# EAGLE schematic PT08ttl (EAGLE 6.6.0)

## Sheet 1 of 2
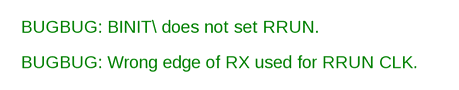
[diagram p0: schematic, sheet 1, part 1 of 2]
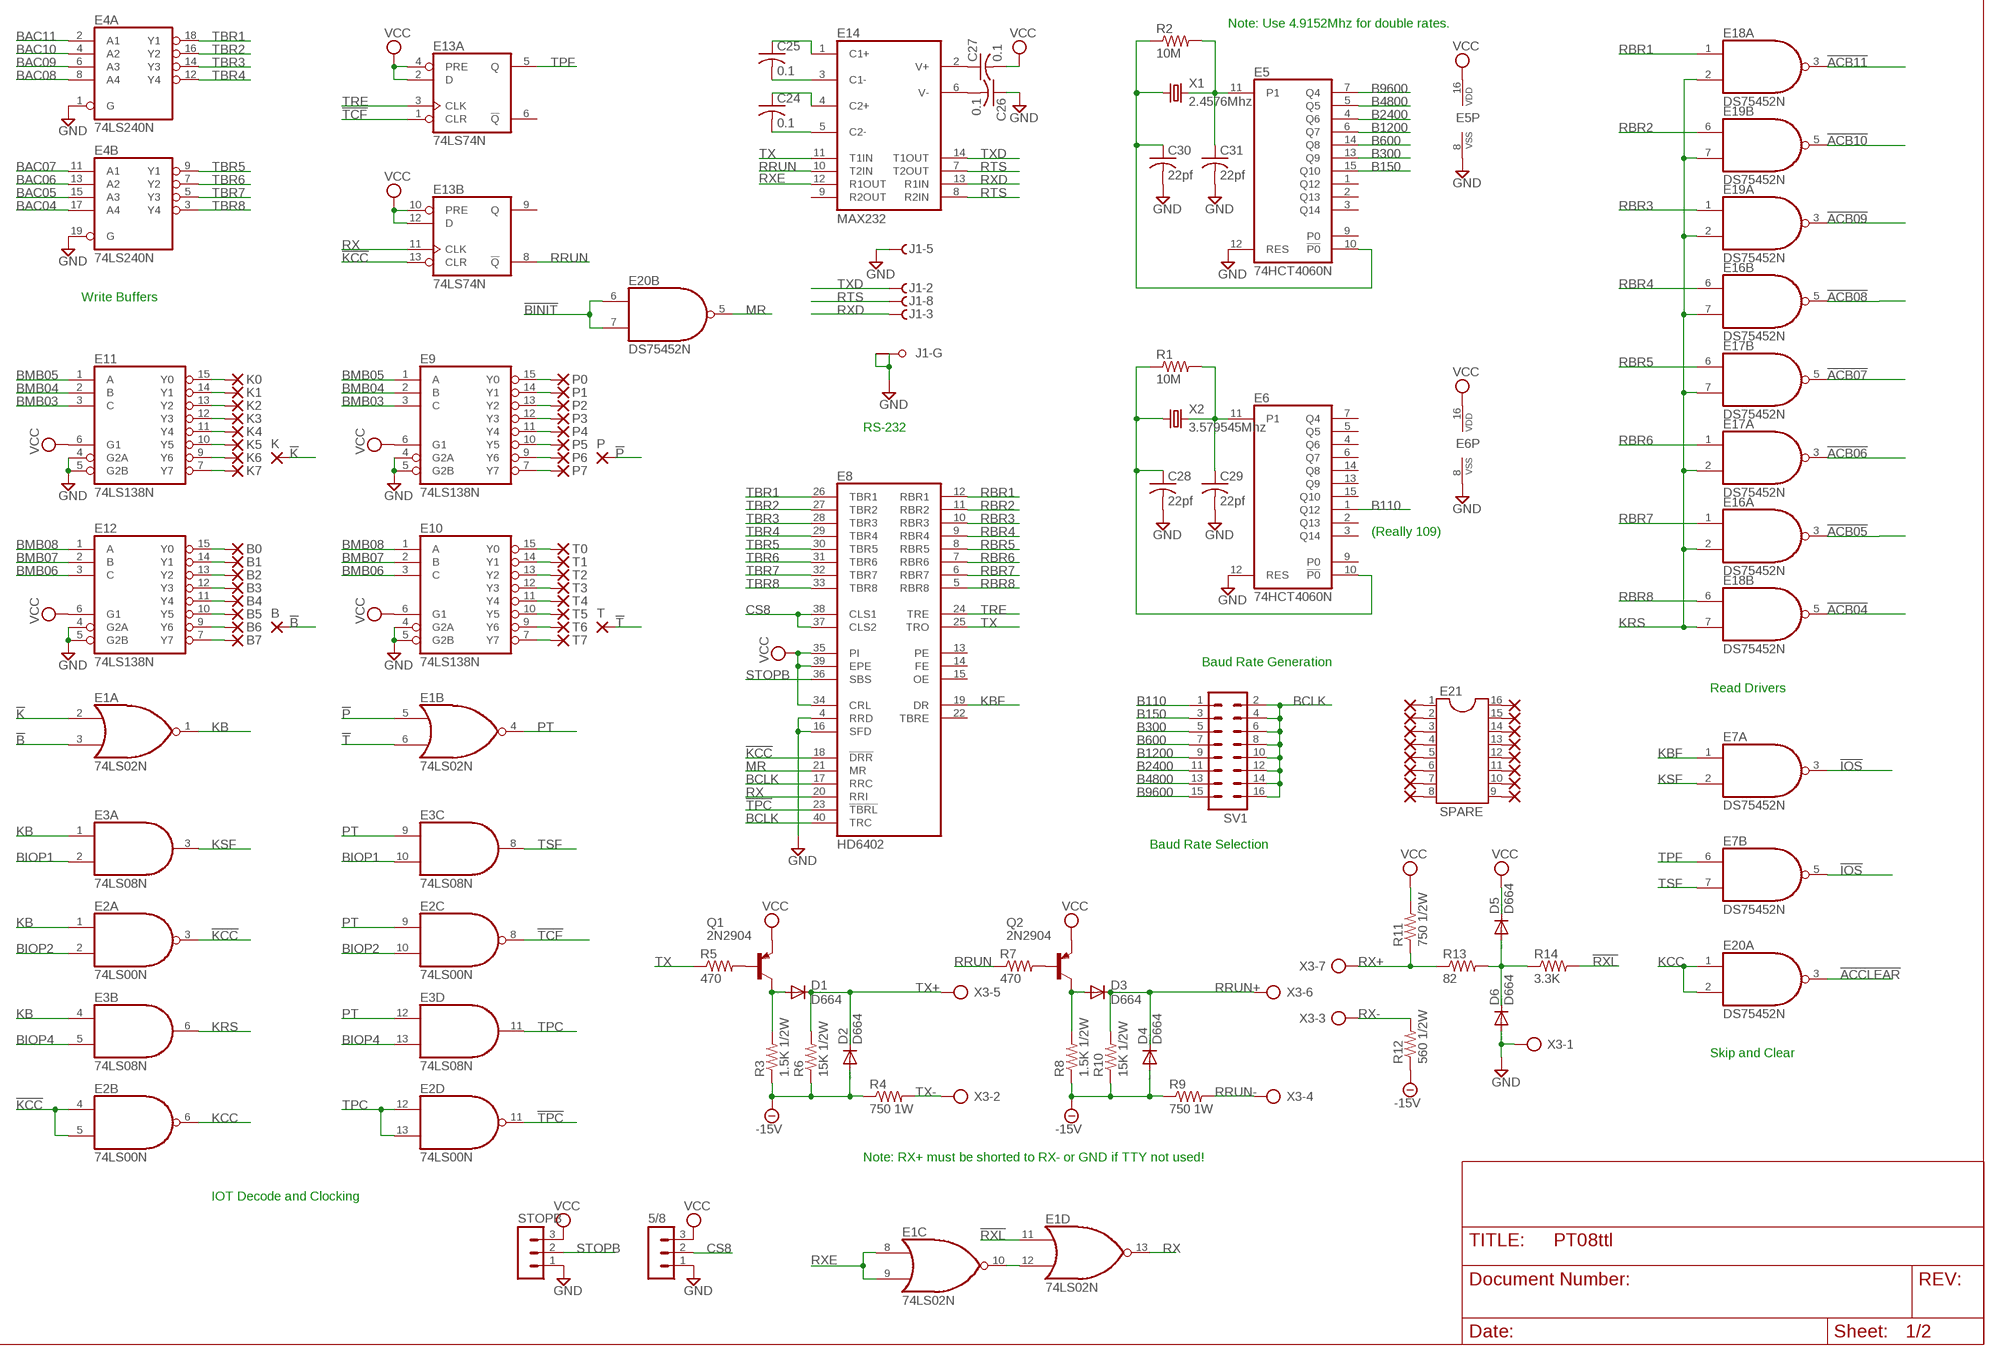
[diagram p1: schematic, sheet 1, part 2 of 2]

### Parts
5/8  MA03-1  [MA03-1]
B  1,6/0,8  [1,6/0,8]
B0  1,6/0,8  [1,6/0,8]
B1  1,6/0,8  [1,6/0,8]
B2  1,6/0,8  [1,6/0,8]
B3  1,6/0,8  [1,6/0,8]
B4  1,6/0,8  [1,6/0,8]
B5  1,6/0,8  [1,6/0,8]
B6  1,6/0,8  [1,6/0,8]
B7  1,6/0,8  [1,6/0,8]
C24  0.1  C-US050-025X075  [C050-025X075]
C25  0.1  C-US050-025X075  [C050-025X075]
C26  0.1  C-US050-025X075  [C050-025X075]
C27  0.1  C-US050-025X075  [C050-025X075]
C28  22pf  C-US050-025X075  [C050-025X075]
C29  22pf  C-US050-025X075  [C050-025X075]
C30  22pf  C-US050-025X075  [C050-025X075]
C31  22pf  C-US050-025X075  [C050-025X075]
D1  D664  1N4148DO35-10  [DO35-10]
D2  D664  1N4148DO35-10  [DO35-10]
D3  D664  1N4148DO35-10  [DO35-10]
D4  D664  1N4148DO35-10  [DO35-10]
D5  D664  1N4148DO35-10  [DO35-10]
D6  D664  1N4148DO35-10  [DO35-10]
E1  74LS02N  [DIL14]
E2  74LS00N  [DIL14]
E3  74LS08N  [DIL14]
E4  74LS240N  [DIL20]
E5  74HCT4060N  4060N  [DIL16]
E6  74HCT4060N  4060N  [DIL16]
E7  DS75452N  [DIL08]
E8  HD6402  [DIL40]
E9  74LS138N  [DIL16]
E10  74LS138N  [DIL16]
E11  74LS138N  [DIL16]
E12  74LS138N  [DIL16]
E13  74LS74N  [DIL14]
E14  MAX232  [DIL16]
E16  DS75452N  [DIL08]
E17  DS75452N  [DIL08]
E18  DS75452N  [DIL08]
E19  DS75452N  [DIL08]
E20  DS75452N  [DIL08]
E21  SPARE  DIL16  [DIL16]
J1  F09HPS  [F09HP]
K  1,6/0,8  [1,6/0,8]
K0  1,6/0,8  [1,6/0,8]
K1  1,6/0,8  [1,6/0,8]
K2  1,6/0,8  [1,6/0,8]
K3  1,6/0,8  [1,6/0,8]
K4  1,6/0,8  [1,6/0,8]
K5  1,6/0,8  [1,6/0,8]
K6  1,6/0,8  [1,6/0,8]
K7  1,6/0,8  [1,6/0,8]
P  1,6/0,8  [1,6/0,8]
P0  1,6/0,8  [1,6/0,8]
P1  1,6/0,8  [1,6/0,8]
P2  1,6/0,8  [1,6/0,8]
P3  1,6/0,8  [1,6/0,8]
P4  1,6/0,8  [1,6/0,8]
P5  1,6/0,8  [1,6/0,8]
P6  1,6/0,8  [1,6/0,8]
P7  1,6/0,8  [1,6/0,8]
PAD18  1,6/0,8  [1,6/0,8]
PAD19  1,6/0,8  [1,6/0,8]
PAD28  1,6/0,8  [1,6/0,8]
PAD29  1,6/0,8  [1,6/0,8]
PAD30  1,6/0,8  [1,6/0,8]
PAD31  1,6/0,8  [1,6/0,8]
PAD32  1,6/0,8  [1,6/0,8]
PAD33  1,6/0,8  [1,6/0,8]
PAD34  1,6/0,8  [1,6/0,8]
PAD35  1,6/0,8  [1,6/0,8]
PAD36  1,6/0,8  [1,6/0,8]
PAD37  1,6/0,8  [1,6/0,8]
PAD38  1,6/0,8  [1,6/0,8]
PAD39  1,6/0,8  [1,6/0,8]
PAD40  1,6/0,8  [1,6/0,8]
PAD41  1,6/0,8  [1,6/0,8]
Q1  2N2904  [TO39]
Q2  2N2904  [TO39]
R1  10M  R-US_0207/10  [0207/10]
R2  10M  R-US_0207/10  [0207/10]
R3  1.5K 1/2W  R-US_0207/10  [0207/10]
R4  750 1W  R-US_0207/10  [0207/10]
R5  470  R-US_0207/10  [0207/10]
R6  15K 1/2W  R-US_0207/10  [0207/10]
R7  470  R-US_0207/10  [0207/10]
R8  1.5K 1/2W  R-US_0207/10  [0207/10]
R9  750 1W  R-US_0207/10  [0207/10]
R10  15K 1/2W  R-US_0207/10  [0207/10]
R11  750 1/2W  R-US_0207/10  [0207/10]
R12  560 1/2W  R-US_0207/10  [0207/10]
R13  82  R-US_0207/10  [0207/10]
R14  3.3K  R-US_0207/10  [0207/10]
STOPB  MA03-1  [MA03-1]
SV1  MA08-2  [MA08-2]
T  1,6/0,8  [1,6/0,8]
T0  1,6/0,8  [1,6/0,8]
T1  1,6/0,8  [1,6/0,8]
T2  1,6/0,8  [1,6/0,8]
T3  1,6/0,8  [1,6/0,8]
T4  1,6/0,8  [1,6/0,8]
T5  1,6/0,8  [1,6/0,8]
T6  1,6/0,8  [1,6/0,8]
T7  1,6/0,8  [1,6/0,8]
X1  2.4576Mhz  CRYSTALHC49U-V  [HC49U-V]
X2  3.579545Mhz  CRYSTALHC49U-V  [HC49U-V]
X3  AK300/7  [AK300/7]

### Nets
!ACB04: E18.5(B:O) ; also sheet 2
!ACB05: E16.3(A:O) ; also sheet 2
!ACB06: E17.3(A:O) ; also sheet 2
!ACB07: E17.5(B:O) ; also sheet 2
!ACB08: E16.5(B:O) ; also sheet 2
!ACB09: E19.3(A:O) ; also sheet 2
!ACB10: E19.5(B:O) ; also sheet 2
!ACB11: E18.3(A:O) ; also sheet 2
!ACCLEAR: E20.3(A:O) ; also sheet 2
!B: B.1(P) E1.3(A:I1)
!BINIT: E20.6(B:I0) E20.7(B:I1) ; also sheet 2
!IOS: E7.3(A:O) E7.5(B:O) ; also sheet 2
!K: E1.2(A:I0) K.1(P)
!KCC: E2.3(A:O) E2.4(B:I0) E2.5(B:I1) E8.18(!DRR) E13.13(B:CLR)
!P: E1.5(B:I0) P.1(P)
!RXL: E1.11(D:I0) R14.2
!T: E1.6(B:I1) T.1(P)
!TCF: E2.8(C:O) E13.1(A:CLR)
!TPC: E2.11(D:O) E8.23(!TBRL)
-15V [supply]: D2.A D4.A R3.1 R4.1 R6.1 R8.1 R9.1 R10.1 R12.1 ; also sheet 2
B110: E6.1(Q12) SV1.1
B150: E5.15(Q10) SV1.3
B300: E5.13(Q9) SV1.5
B600: E5.14(Q8) SV1.7
B1200: E5.6(Q7) SV1.9
B2400: E5.4(Q6) SV1.11
B4800: E5.5(Q5) SV1.13
B9600: E5.7(Q4) SV1.15
BAC04: E4.17(B:A4) ; also sheet 2
BAC05: E4.15(B:A3) ; also sheet 2
BAC06: E4.13(B:A2) ; also sheet 2
BAC07: E4.11(B:A1) ; also sheet 2
BAC08: E4.8(A:A4) ; also sheet 2
BAC09: E4.6(A:A3) ; also sheet 2
BAC10: E4.4(A:A2) ; also sheet 2
BAC11: E4.2(A:A1) ; also sheet 2
BCLK: E8.17(RRC) E8.40(TRC) SV1.2 SV1.4 SV1.6 SV1.8 SV1.10 SV1.12 SV1.14 SV1.16
BIOP1: E3.2(A:I1) E3.10(C:I1) ; also sheet 2
BIOP2: E2.2(A:I1) E2.10(C:I1) ; also sheet 2
BIOP4: E3.5(B:I1) E3.13(D:I1) ; also sheet 2
BMB03: E9.3(C) E11.3(C) ; also sheet 2
BMB04: E9.2(B) E11.2(B) ; also sheet 2
BMB05: E9.1(A) E11.1(A) ; also sheet 2
BMB06: E10.3(C) E12.3(C) ; also sheet 2
BMB07: E10.2(B) E12.2(B) ; also sheet 2
BMB08: E10.1(A) E12.1(A) ; also sheet 2
CS8: 5/8.2 E8.37(CLS2) E8.38(CLS1)
GND [supply]: 5/8.1 C26.1 C28.2 C29.2 C30.2 C31.2 D6.A E4.1(A:G) E4.19(B:G) E5.8(VSS) E5.12(RES) E6.8(VSS) E6.12(RES) E8.4(RRD) E8.16(SFD) E9.4(G2A) E9.5(G2B) E10.4(G2A) E10.5(G2B) E11.4(G2A) E11.5(G2B) E12.4(G2A) E12.5(G2B) J1.5(-5:F) J1.G1(-G:G1) J1.G2(-G:G2) STOPB.1 X3.1 ; also sheet 2
KB: E1.1(A:O) E2.1(A:I0) E3.1(A:I0) E3.4(B:I0)
KBF: E7.1(A:I0) E8.19(DR)
KCC: E2.6(B:O) E20.1(A:I0) E20.2(A:I1)
KRS: E3.6(B:O) E16.2(A:I1) E16.7(B:I1) E17.2(A:I1) E17.7(B:I1) E18.2(A:I1) E18.7(B:I1) E19.2(A:I1) E19.7(B:I1)
KSF: E3.3(A:O) E7.2(A:I1)
MR: E8.21(MR) E20.5(B:O)
N$1: B6.1(P) E12.9(Y6)
N$5: B0.1(P) E12.15(Y0)
N$6: B1.1(P) E12.14(Y1)
N$7: B2.1(P) E12.13(Y2)
N$8: B3.1(P) E12.12(Y3)
N$9: B4.1(P) E12.11(Y4)
N$10: B5.1(P) E12.10(Y5)
N$11: B7.1(P) E12.7(Y7)
N$13: C29.1 E6.11(P1) R1.2 X2.2
N$14: C28.1 E6.10(!P0) R1.1 X2.1
N$15 [supply]: C26.2 E14.6(V-)
N$16 [supply]: C27.1 E14.2(V+)
N$17: Q1.2(B) R5.2
N$18: D1.A Q1.3(C) R3.2
N$19: Q2.2(B) R7.2
N$20: D3.A Q2.3(C) R8.2
N$22: C24.2 E14.5(C2-)
N$23: C30.1 E5.10(!P0) R2.1 X1.1
N$24: D5.A D6.C R13.2 R14.1
N$25: C31.1 E5.11(P1) R2.2 X1.2
N$27: E1.10(C:O) E1.12(D:I1)
N$32: C25.2 E14.3(C1-)
N$34: E21.1 PAD18.1(P)
N$41: E21.2 PAD19.1(P)
N$43: E21.3 PAD28.1(P)
N$44: C24.1 E14.4(C2+)
N$45: C25.1 E14.1(C1+)
N$49: E10.15(Y0) T0.1(P)
N$50: E21.4 PAD29.1(P)
N$51: E21.5 PAD30.1(P)
N$52: E21.6 PAD31.1(P)
N$53: E21.7 PAD32.1(P)
N$54: E21.8 PAD33.1(P)
N$55: E21.16 PAD34.1(P)
N$56: E21.15 PAD35.1(P)
N$57: E21.14 PAD36.1(P)
N$58: E21.13 PAD37.1(P)
N$59: E21.12 PAD38.1(P)
N$61: E21.11 PAD39.1(P)
N$68: E21.10 PAD40.1(P)
N$69: E21.9 PAD41.1(P)
N$90: E11.15(Y0) K0.1(P)
N$91: E11.14(Y1) K1.1(P)
N$97: E11.13(Y2) K2.1(P)
N$109: E11.12(Y3) K3.1(P)
N$112: E11.11(Y4) K4.1(P)
N$113: E11.10(Y5) K5.1(P)
N$114: E11.7(Y7) K7.1(P)
N$115: E11.9(Y6) K6.1(P)
N$116: E10.14(Y1) T1.1(P)
N$117: E10.13(Y2) T2.1(P)
N$118: E10.12(Y3) T3.1(P)
N$119: E10.11(Y4) T4.1(P)
N$120: E10.10(Y5) T5.1(P)
N$121: E10.7(Y7) T7.1(P)
N$122: E10.9(Y6) T6.1(P)
N$123: E9.15(Y0) P0.1(P)
N$124: E9.14(Y1) P1.1(P)
N$125: E9.13(Y2) P2.1(P)
N$126: E9.12(Y3) P3.1(P)
N$127: E9.11(Y4) P4.1(P)
N$128: E9.10(Y5) P5.1(P)
N$129: E9.7(Y7) P7.1(P)
N$130: E9.9(Y6) P6.1(P)
PT: E1.4(B:O) E2.9(C:I0) E3.9(C:I0) E3.12(D:I0)
RBR1: E8.12(RBR1) E18.1(A:I0)
RBR2: E8.11(RBR2) E19.6(B:I0)
RBR3: E8.10(RBR3) E19.1(A:I0)
RBR4: E8.9(RBR4) E16.6(B:I0)
RBR5: E8.8(RBR5) E17.6(B:I0)
RBR6: E8.7(RBR6) E17.1(A:I0)
RBR7: E8.6(RBR7) E16.1(A:I0)
RBR8: E8.5(RBR8) E18.6(B:I0)
RRUN: E13.8(B:!Q) E14.10(T2IN) R7.1
RRUN+: D3.C D4.C R10.2 X3.6
RRUN-: R9.2 X3.4
RTS: E14.7(T2OUT) E14.8(R2IN) J1.8(-8:F)
RX: E1.13(D:O) E8.20(RRI) E13.11(B:CLK)
RX+: R11.1 R13.1 X3.7
RX-: R12.2 X3.3
RXD: E14.13(R1IN) J1.3(-3:F)
RXE: E1.8(C:I0) E1.9(C:I1) E14.12(R1OUT)
STOPB: E8.36(SBS) STOPB.2
TBR1: E4.18(A:Y1) E8.26(TBR1)
TBR2: E4.16(A:Y2) E8.27(TBR2)
TBR3: E4.14(A:Y3) E8.28(TBR3)
TBR4: E4.12(A:Y4) E8.29(TBR4)
TBR5: E4.9(B:Y1) E8.30(TBR5)
TBR6: E4.7(B:Y2) E8.31(TBR6)
TBR7: E4.5(B:Y3) E8.32(TBR7)
TBR8: E4.3(B:Y4) E8.33(TBR8)
TPC: E2.12(D:I0) E2.13(D:I1) E3.11(D:O)
TPF: E7.6(B:I0) E13.5(A:Q)
TRE: E8.24(TRE) E13.3(A:CLK)
TSF: E3.8(C:O) E7.7(B:I1)
TX: E8.25(TRO) E14.11(T1IN) R5.1
TX+: D1.C D2.C R6.2 X3.5
TX-: R4.2 X3.2
TXD: E14.14(T1OUT) J1.2(-2:F)
VCC [supply]: 5/8.3 C27.2 D5.C E5.16(VDD) E6.16(VDD) E8.34(CRL) E8.35(PI) E8.39(EPE) E9.6(G1) E10.6(G1) E11.6(G1) E12.6(G1) E13.2(A:D) E13.4(A:PRE) E13.10(B:PRE) E13.12(B:D) Q1.1(E) Q2.1(E) R11.2 STOPB.3 ; also sheet 2
Unconnected: E5.1(Q12) E5.2(Q13) E5.3(Q14) E5.9(P0) E6.2(Q13) E6.3(Q14) E6.4(Q6) E6.5(Q5) E6.6(Q7) E6.7(Q4) E6.9(P0) E6.13(Q9) E6.14(Q8) E6.15(Q10) E8.13(PE) E8.14(FE) E8.15(OE) E8.22(TBRE) E13.6(A:!Q) E13.9(B:Q) E14.9(R2OUT) J1.1(-1:F) J1.4(-4:F) J1.6(-6:F) J1.7(-7:F) J1.9(-9:F)

### Notes on the sheet
- Note: Use 4.9152Mhz for double rates.
- BUGBUG: BINIT\\ does not set RRUN.
- BUGBUG: Wrong edge of RX used for RRUN CLK.
- Write Buffers
- RS-232
- (Really 109)
- Baud Rate Generation
- Read Drivers
- Baud Rate Selection
- Skip and Clear
- Note: RX+ must be shorted to RX- or GND if TTY not used!
- IOT Decode and Clocking

## Sheet 2 of 2
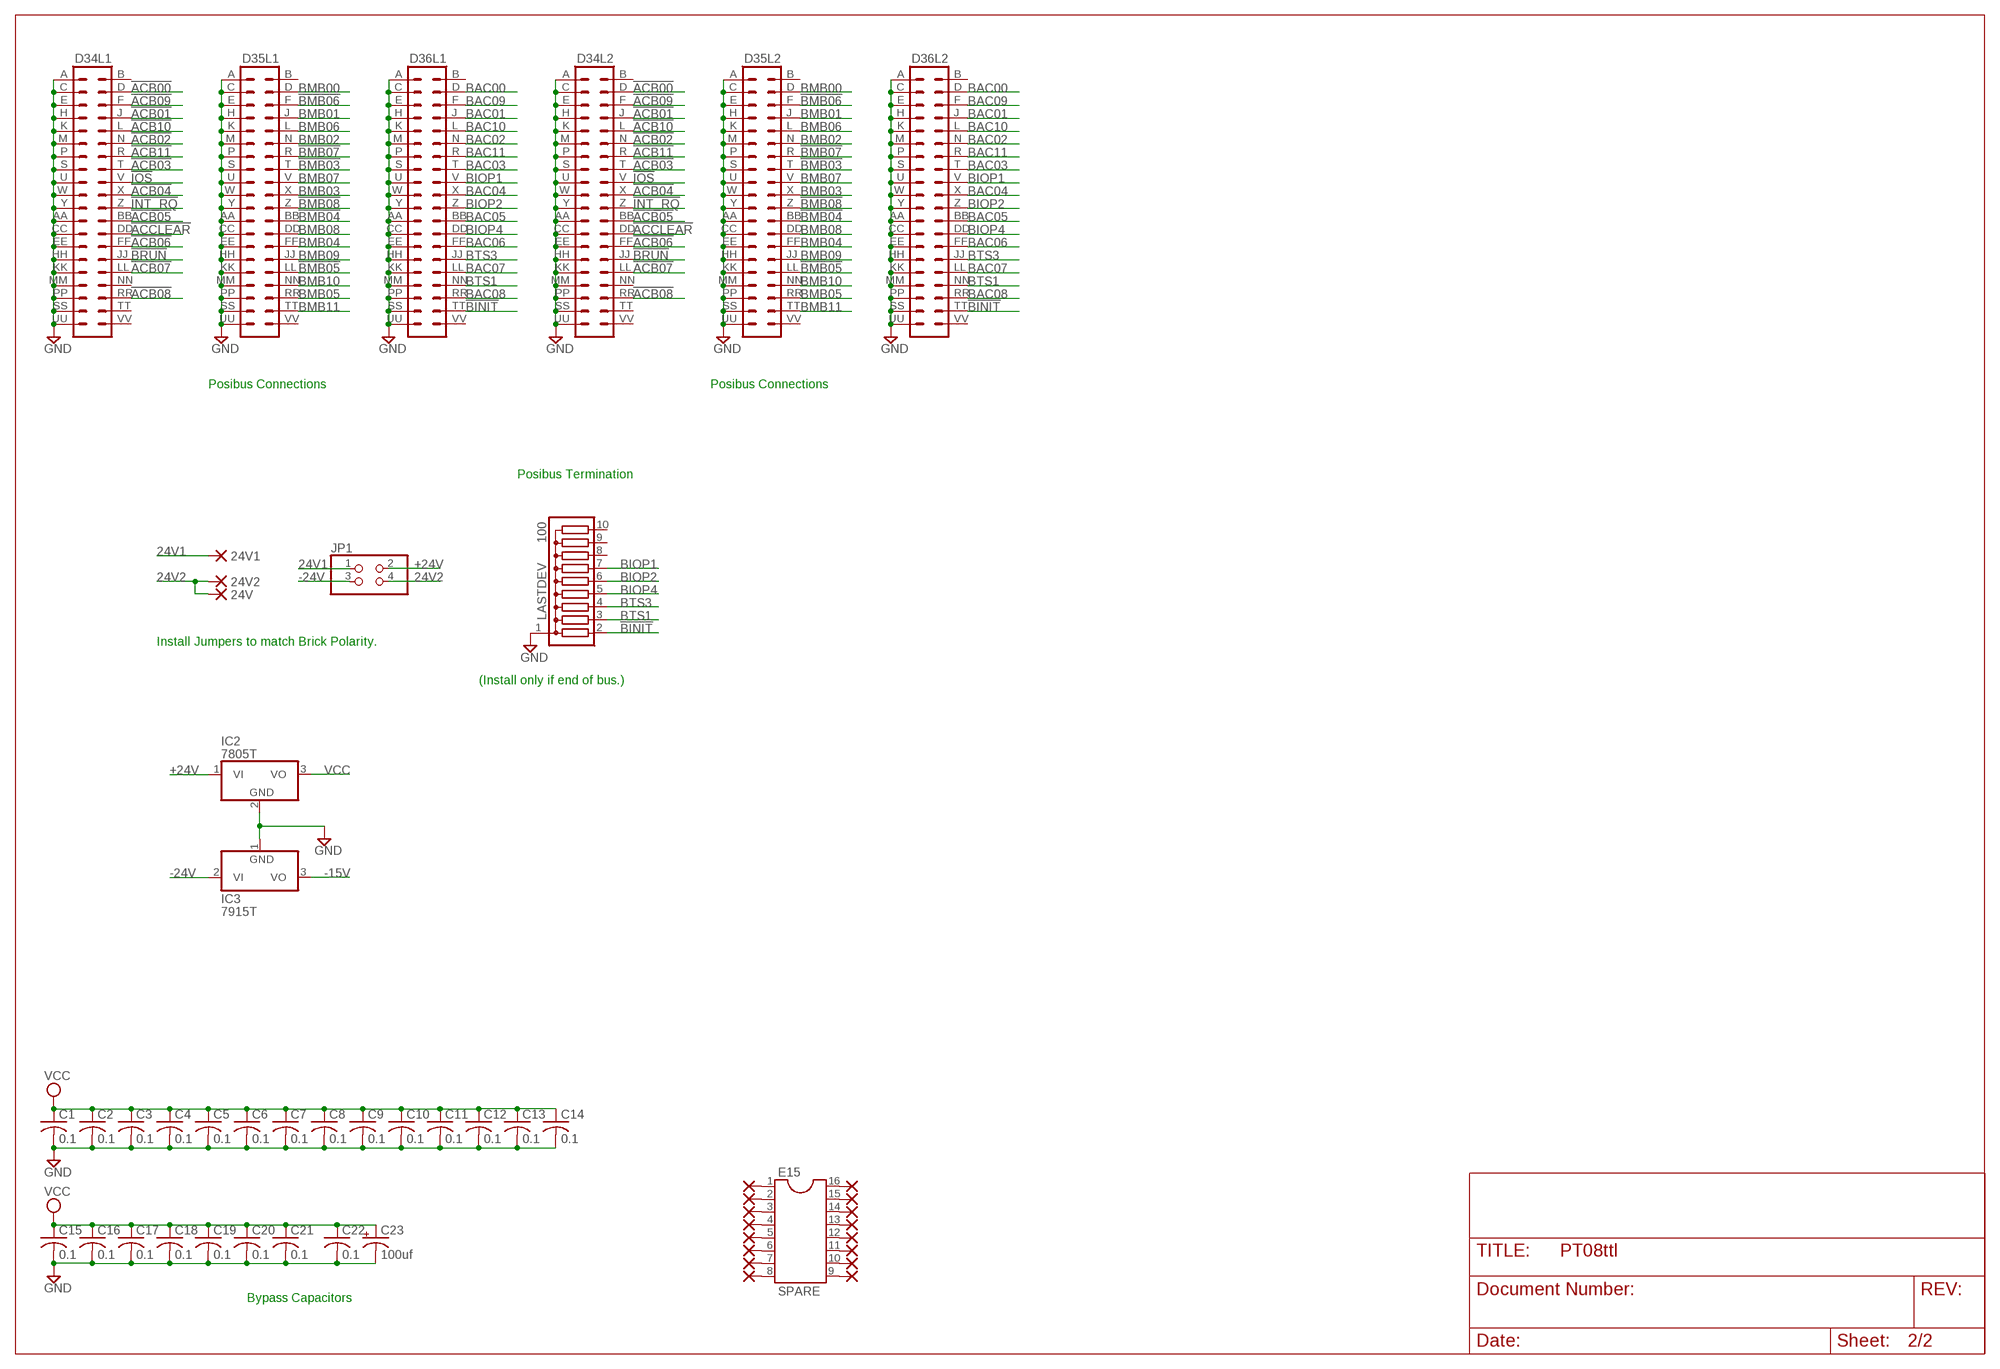
[diagram p2: schematic, sheet 2]

### Parts
24V  PAD-0820  [0820]
24V1  PAD-0820  [0820]
24V2  PAD-0820  [0820]
C1  0.1  C-US050-025X075  [C050-025X075]
C2  0.1  C-US050-025X075  [C050-025X075]
C3  0.1  C-US050-025X075  [C050-025X075]
C4  0.1  C-US050-025X075  [C050-025X075]
C5  0.1  C-US050-025X075  [C050-025X075]
C6  0.1  C-US050-025X075  [C050-025X075]
C7  0.1  C-US050-025X075  [C050-025X075]
C8  0.1  C-US050-025X075  [C050-025X075]
C9  0.1  C-US050-025X075  [C050-025X075]
C10  0.1  C-US050-025X075  [C050-025X075]
C11  0.1  C-US050-025X075  [C050-025X075]
C12  0.1  C-US050-025X075  [C050-025X075]
C13  0.1  C-US050-025X075  [C050-025X075]
C14  0.1  C-US050-025X075  [C050-025X075]
C15  0.1  C-US050-025X075  [C050-025X075]
C16  0.1  C-US050-025X075  [C050-025X075]
C17  0.1  C-US050-025X075  [C050-025X075]
C18  0.1  C-US050-025X075  [C050-025X075]
C19  0.1  C-US050-025X075  [C050-025X075]
C20  0.1  C-US050-025X075  [C050-025X075]
C21  0.1  C-US050-025X075  [C050-025X075]
C22  0.1  C-US050-025X075  [C050-025X075]
C23  100uf  CPOL-USE22-9AXIAL  [E22-9]
D34L1  DEC40PINV  [DEC40PINV]
D34L2  DEC40PINV  [DEC40PINV]
D35L1  DEC40PINV  [DEC40PINV]
D35L2  DEC40PINV  [DEC40PINV]
D36L1  DEC40PINV  [DEC40PINV]
D36L2  DEC40PINV  [DEC40PINV]
E15  SPARE  DIL16  [DIL16]
IC2  7805T  [TO220H]
IC3  7915T  [TO220H]
JP1  PINHD-2X2  [2X02]
LASTDEV  100  G09R  [SIL10]
PAD1  1,6/0,8  [1,6/0,8]
PAD2  1,6/0,8  [1,6/0,8]
PAD3  1,6/0,8  [1,6/0,8]
PAD4  1,6/0,8  [1,6/0,8]
PAD5  1,6/0,8  [1,6/0,8]
PAD6  1,6/0,8  [1,6/0,8]
PAD7  1,6/0,8  [1,6/0,8]
PAD8  1,6/0,8  [1,6/0,8]
PAD9  1,6/0,8  [1,6/0,8]
PAD42  1,6/0,8  [1,6/0,8]
PAD43  1,6/0,8  [1,6/0,8]
PAD44  1,6/0,8  [1,6/0,8]
PAD45  1,6/0,8  [1,6/0,8]
PAD46  1,6/0,8  [1,6/0,8]
PAD47  1,6/0,8  [1,6/0,8]
PAD48  1,6/0,8  [1,6/0,8]

### Nets
24V1 [supply]: 24V1.P$1(P) JP1.1
24V2 [supply]: 24V2.P$1(P) 24V.P$1(P) JP1.4
!ACB00: D34L1.D D34L2.D
!ACB01: D34L1.J D34L2.J
!ACB02: D34L1.N D34L2.N
!ACB03: D34L1.T D34L2.T
!ACB04: D34L1.X D34L2.X ; also sheet 1
!ACB05: D34L1.BB D34L2.BB ; also sheet 1
!ACB06: D34L1.FF D34L2.FF ; also sheet 1
!ACB07: D34L1.LL D34L2.LL ; also sheet 1
!ACB08: D34L1.RR D34L2.RR ; also sheet 1
!ACB09: D34L1.F D34L2.F ; also sheet 1
!ACB10: D34L1.L D34L2.L ; also sheet 1
!ACB11: D34L1.R D34L2.R ; also sheet 1
!ACCLEAR: D34L1.DD D34L2.DD ; also sheet 1
!BINIT: D36L1.TT D36L2.TT LASTDEV.2 ; also sheet 1
!BMB03: D35L1.T D35L2.T
!BMB04: D35L1.BB D35L2.BB
!BMB05: D35L1.LL D35L2.LL
!BMB06: D35L1.F D35L2.F
!BMB07: D35L1.R D35L2.R
!BMB08: D35L1.Z D35L2.Z
!BRUN: D34L1.JJ D34L2.JJ
!INT_RQ: D34L1.Z D34L2.Z
!IOS: D34L1.V D34L2.V ; also sheet 1
+24V [supply]: IC2.1(VI) JP1.2
-15V [supply]: IC3.3(VO) ; also sheet 1
-24V [supply]: IC3.2(VI) JP1.3
BAC00: D36L1.D D36L2.D
BAC01: D36L1.J D36L2.J
BAC02: D36L1.N D36L2.N
BAC03: D36L1.T D36L2.T
BAC04: D36L1.X D36L2.X ; also sheet 1
BAC05: D36L1.BB D36L2.BB ; also sheet 1
BAC06: D36L1.FF D36L2.FF ; also sheet 1
BAC07: D36L1.LL D36L2.LL ; also sheet 1
BAC08: D36L1.RR D36L2.RR ; also sheet 1
BAC09: D36L1.F D36L2.F ; also sheet 1
BAC10: D36L1.L D36L2.L ; also sheet 1
BAC11: D36L1.R D36L2.R ; also sheet 1
BIOP1: D36L1.V D36L2.V LASTDEV.7 ; also sheet 1
BIOP2: D36L1.Z D36L2.Z LASTDEV.6 ; also sheet 1
BIOP4: D36L1.DD D36L2.DD LASTDEV.5 ; also sheet 1
BMB00: D35L1.D D35L2.D
BMB01: D35L1.J D35L2.J
BMB02: D35L1.N D35L2.N
BMB03: D35L1.X D35L2.X ; also sheet 1
BMB04: D35L1.FF D35L2.FF ; also sheet 1
BMB05: D35L1.RR D35L2.RR ; also sheet 1
BMB06: D35L1.L D35L2.L ; also sheet 1
BMB07: D35L1.V D35L2.V ; also sheet 1
BMB08: D35L1.DD D35L2.DD ; also sheet 1
BMB09: D35L1.JJ D35L2.JJ
BMB10: D35L1.NN D35L2.NN
BMB11: D35L1.TT D35L2.TT
BTS1: D36L1.NN D36L2.NN LASTDEV.3
BTS3: D36L1.JJ D36L2.JJ LASTDEV.4
GND [supply]: C1.2 C2.2 C3.2 C4.2 C5.2 C6.2 C7.2 C8.2 C9.2 C10.2 C11.2 C12.2 C13.2 C14.2 C15.2 C16.2 C17.2 C18.2 C19.2 C20.2 C21.2 C22.2 C23.- D34L1.A D34L1.AA D34L1.C D34L1.CC D34L1.E D34L1.EE D34L1.H D34L1.HH D34L1.K D34L1.KK D34L1.M D34L1.MM D34L1.P D34L1.PP D34L1.S D34L1.SS D34L1.U D34L1.UU D34L1.W D34L1.Y D34L2.A D34L2.AA D34L2.C D34L2.CC D34L2.E D34L2.EE D34L2.H D34L2.HH D34L2.K D34L2.KK D34L2.M D34L2.MM D34L2.P D34L2.PP D34L2.S D34L2.SS D34L2.U D34L2.UU D34L2.W D34L2.Y D35L1.A D35L1.AA D35L1.C D35L1.CC D35L1.E D35L1.EE D35L1.H D35L1.HH D35L1.K D35L1.KK D35L1.M D35L1.MM D35L1.P D35L1.PP D35L1.S D35L1.SS D35L1.U D35L1.UU D35L1.W D35L1.Y D35L2.A D35L2.AA D35L2.C D35L2.CC D35L2.E D35L2.EE D35L2.H D35L2.HH D35L2.K D35L2.KK D35L2.M D35L2.MM D35L2.P D35L2.PP D35L2.S D35L2.SS D35L2.U D35L2.UU D35L2.W D35L2.Y D36L1.A D36L1.AA D36L1.C D36L1.CC D36L1.E D36L1.EE D36L1.H D36L1.HH D36L1.K D36L1.KK D36L1.M D36L1.MM D36L1.P D36L1.PP D36L1.S D36L1.SS D36L1.U D36L1.UU D36L1.W D36L1.Y D36L2.A D36L2.AA D36L2.C D36L2.CC D36L2.E D36L2.EE D36L2.H D36L2.HH D36L2.K D36L2.KK D36L2.M D36L2.MM D36L2.P D36L2.PP D36L2.S D36L2.SS D36L2.U D36L2.UU D36L2.W D36L2.Y IC2.2(GND) IC3.1(GND) LASTDEV.1 ; also sheet 1
N$2: E15.1 PAD1.1(P)
N$3: E15.2 PAD2.1(P)
N$4: E15.3 PAD3.1(P)
N$12: E15.4 PAD4.1(P)
N$21: E15.5 PAD5.1(P)
N$31: E15.6 PAD6.1(P)
N$33: E15.7 PAD7.1(P)
N$35: E15.8 PAD8.1(P)
N$37: E15.16 PAD9.1(P)
N$38: E15.15 PAD42.1(P)
N$39: E15.14 PAD43.1(P)
N$40: E15.13 PAD44.1(P)
N$42: E15.12 PAD45.1(P)
N$46: E15.11 PAD46.1(P)
N$47: E15.10 PAD47.1(P)
N$48: E15.9 PAD48.1(P)
VCC [supply]: C1.1 C2.1 C3.1 C4.1 C5.1 C6.1 C7.1 C8.1 C9.1 C10.1 C11.1 C12.1 C13.1 C14.1 C15.1 C16.1 C17.1 C18.1 C19.1 C20.1 C21.1 C22.1 C23.+ IC2.3(VO) ; also sheet 1
Unconnected: D34L1.B D34L1.NN D34L1.TT D34L1.VV D34L2.B D34L2.NN D34L2.TT D34L2.VV D35L1.B D35L1.VV D35L2.B D35L2.VV D36L1.B D36L1.VV D36L2.B D36L2.VV LASTDEV.8 LASTDEV.9 LASTDEV.10

### Notes on the sheet
- Posibus Connections | Posibus Connections
- Posibus Termination
- Install Jumpers to match Brick Polarity.
- (Install only if end of bus.)
- Bypass Capacitors

## Power pins joined to a net without a drawn wire
GND: E1.7(P:GND) E2.7(P:GND) E3.7(P:GND) E4.10(P:GND) E7.4(P:GND) E8.3(GND) E9.8(GND) E10.8(GND) E11.8(GND) E12.8(GND) E13.7(P:GND) E14.15(GND) E16.4(P:GND) E17.4(P:GND) E18.4(P:GND) E19.4(P:GND) E20.4(P:GND)
VCC: E1.14(P:VCC) E2.14(P:VCC) E3.14(P:VCC) E4.20(P:VCC) E7.8(P:VCC) E8.1(VCC) E9.16(VCC) E10.16(VCC) E11.16(VCC) E12.16(VCC) E13.14(P:VCC) E14.16(VCC) E16.8(P:VCC) E17.8(P:VCC) E18.8(P:VCC) E19.8(P:VCC) E20.8(P:VCC)

## Library data of the parts
5/8 STOPB = con-lstb:MA03-1: PIN HEADER; OC_FARNELL: unknown; OC_NEWARK: unknown
24V 24V1 24V2 = dec-con:PAD: WIRE PAD Standard US Drill Sizes
B B0 B1-B7 K K0 K1-K7 P P0 P1-P7 PAD1-PAD9 PAD18 PAD19 PAD28-PAD48 T T0 T1-T7 = wirepad:1,6/0,8: THROUGH-HOLE PAD
C1-C22 C24-C31 = rcl:C-US: CAPACITOR, American symbol
C23 = rcl:CPOL-US: POLARIZED CAPACITOR, American symbol
D1-D6 = diode:1N4148: DIODE high speed (Philips)
D34L1 D34L2 D35L1 D35L2 D36L1 D36L2 = dec-con:DEC40PIN: PIN HEADER
E1 = 74xx-us:74*02: Quad 2-input NOR gate
E2 = 74xx-us:74*00: Quad 2-input NAND gate
E3 = 74xx-us:74*08: Quad 2-input AND gate
E4 = 74xx-us:74*240: Octal BUFFER and LINE DRIVER, 3-state
E5 E6 = 40xx:4060: 14-stage binary/ripple COUNTER
E7 E16-E20 = dec-con:DS75452: Quad 2-input NAND gate, open collector output
E8 = micro-harris:HD6402: MICROCONTROLLER/MEMORY DEVICE; OC_FARNELL: unknown; OC_NEWARK: unknown
E9-E12 = 74xx-us:74*138: 3-line to 8-line DECODER/DEMULTIPLEXER
E13 = 74xx-us:74*74: Dual D type positive edge triggered FLIP FLOP, preset and clear
E14 = maxim:MAX232: RS232 TRANSCEIVER; MF: MAXIM; MPN: MAX232ACPE+; OC_FARNELL: 9723773; OC_NEWARK: 68K4544
E15 E21 = ic-package:DIL16: Dual In Line / Socket
IC2 = linear:78*: Positive VOLTAGE REGULATOR Source: http://cache.national.com/ds/LM/LM78L05.pdf http://www.fairchildsemi.com/ds/LM/LM7805.pdf
IC3 = linear:79*: Negative VOLTAGE REGULATOR
J1 = con-subd:F09HPS: SUB-D; OC_FARNELL: unknown; OC_NEWARK: unknown
JP1 = pinhead:PINHD-2X2: PIN HEADER
LASTDEV = resistor-sil:G09R: SIL RESISTOR; OC_FARNELL: unknown; OC_NEWARK: unknown
Q1 Q2 = transistor-pnp:2N2904*: PNP Transistror
R1-R14 = rcl:R-US_: RESISTOR, American symbol
SV1 = con-lstb:MA08-2: PIN HEADER; OC_FARNELL: unknown; OC_NEWARK: unknown
X1 X2 = crystal:CRYSTAL: CRYSTAL; OC_FARNELL: 1666969; OC_NEWARK: unknown
X3 = con-ptr500:AK300/7: CONNECTOR; OC_FARNELL: unknown; OC_NEWARK: unknown

## Net classes
1 supply: width 0.508 mm